# Altium schematic sheet SchematicPowerSupply_V1.SchDoc
size A4; DocumentNumber: 4; SheetNumber: 4; SheetTotal: 4
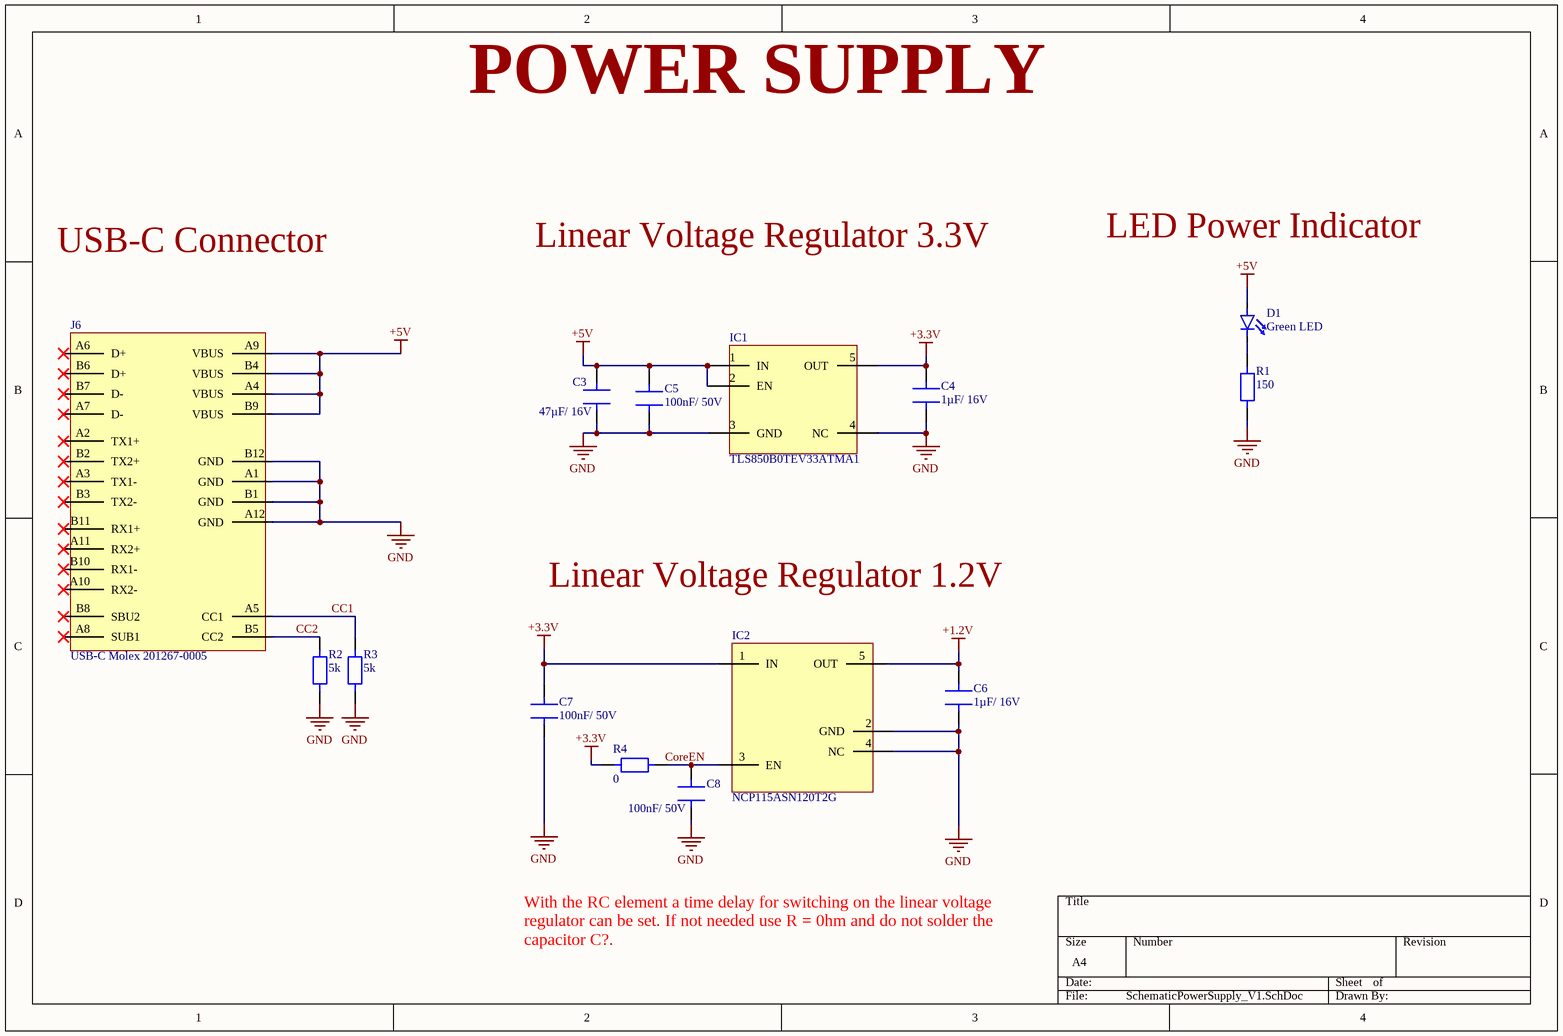
[diagram p0: SchematicPowerSupply_V1.SchDoc]

## Parts
C3  47µF/ 16V  [C1210]
C4  1µF/ 16V  [C0603]
C5  100nF/ 50V  [C0603]
C6  1µF/ 16V  [C0603]
C7  100nF/ 50V  [C0603]
C8  100nF/ 50V  [C0603]
D1  Green LED  [LED_0805]
IC1  TLS850B0TEV33ATMA1  [TO-252-5]
IC2  NCP115ASN120T2G  [TSOP-5]
J6  USB-C Molex 201267-0005  [USB-C Molex 2012670005]
R1  150  [R0603]
R2  5k  [R0603]
R3  5k  [R0603]
R4  0  [R0603]

## Nets
+1.2V: C6.2 IC2.5(OUT)
+3.3V: C4.2 C7.2 IC1.5(OUT) IC2.1(IN) R4.2
+5V: C3.2 C5.2 D1.1 IC1.1(IN) IC1.2(EN) J6.A4(VBUS) J6.A9(VBUS) J6.B4(VBUS) J6.B9(VBUS)
GND: C3.1 C4.1 C5.1 C6.1 C7.1 C8.1 IC1.3(GND) IC1.4(NC) IC2.2(GND) IC2.4(NC) J6.A1(GND) J6.A12(GND) J6.B1(GND) J6.B12(GND) R1.1 R2.1 R3.1
CC1: J6.A5(CC1) R3.2
CC2: J6.B5(CC2) R2.2
CoreEN: C8.2 IC2.3(EN) R4.1
NetD1_2: D1.2 R1.2

Not connected (* = marked no-connect by the designer): J6 A2(TX1+)* A3(TX1-)* A6(D+)* A7(D-)* A8(SUB1)* A10(RX2-)* A11(RX2+)* B2(TX2+)* B3(TX2-)* B6(D+)* B7(D-)* B8(SBU2)* B10(RX1-)* B11(RX1+)*

## Notes on the sheet
- POWER SUPPLY
- LED Power Indicator
- USB-C Connector
- Linear Voltage Regulator 3.3V
- Linear Voltage Regulator 1.2V
- With the RC element a time delay for switching on the linear voltage regulator can be set. If not needed use R = 0hm and do not solder the capacitor C?.

## Library data of the parts
C3 = C 47µF/ 16V: C1210
C4 C6 = C 1µF/ 16V: C0603/C0805
C5 C7 C8 = C 100nF/ 50V: C0603/C0805
D1 = LED 0805: Status LED
IC1 = TLS850B0TEV33ATMA1: Input 3-40V, Output 3.3V
IC2 = NCP115ASN120T2G: Input 1.7V-5.5V, Ouput 1.2V
R1 = RES_150: 0603/0805
R2 R3 = RES_5k: 0603/0805
R4 = RES_0: 0603/0805